# EAGLE design sensor (EAGLE 7.2.0)
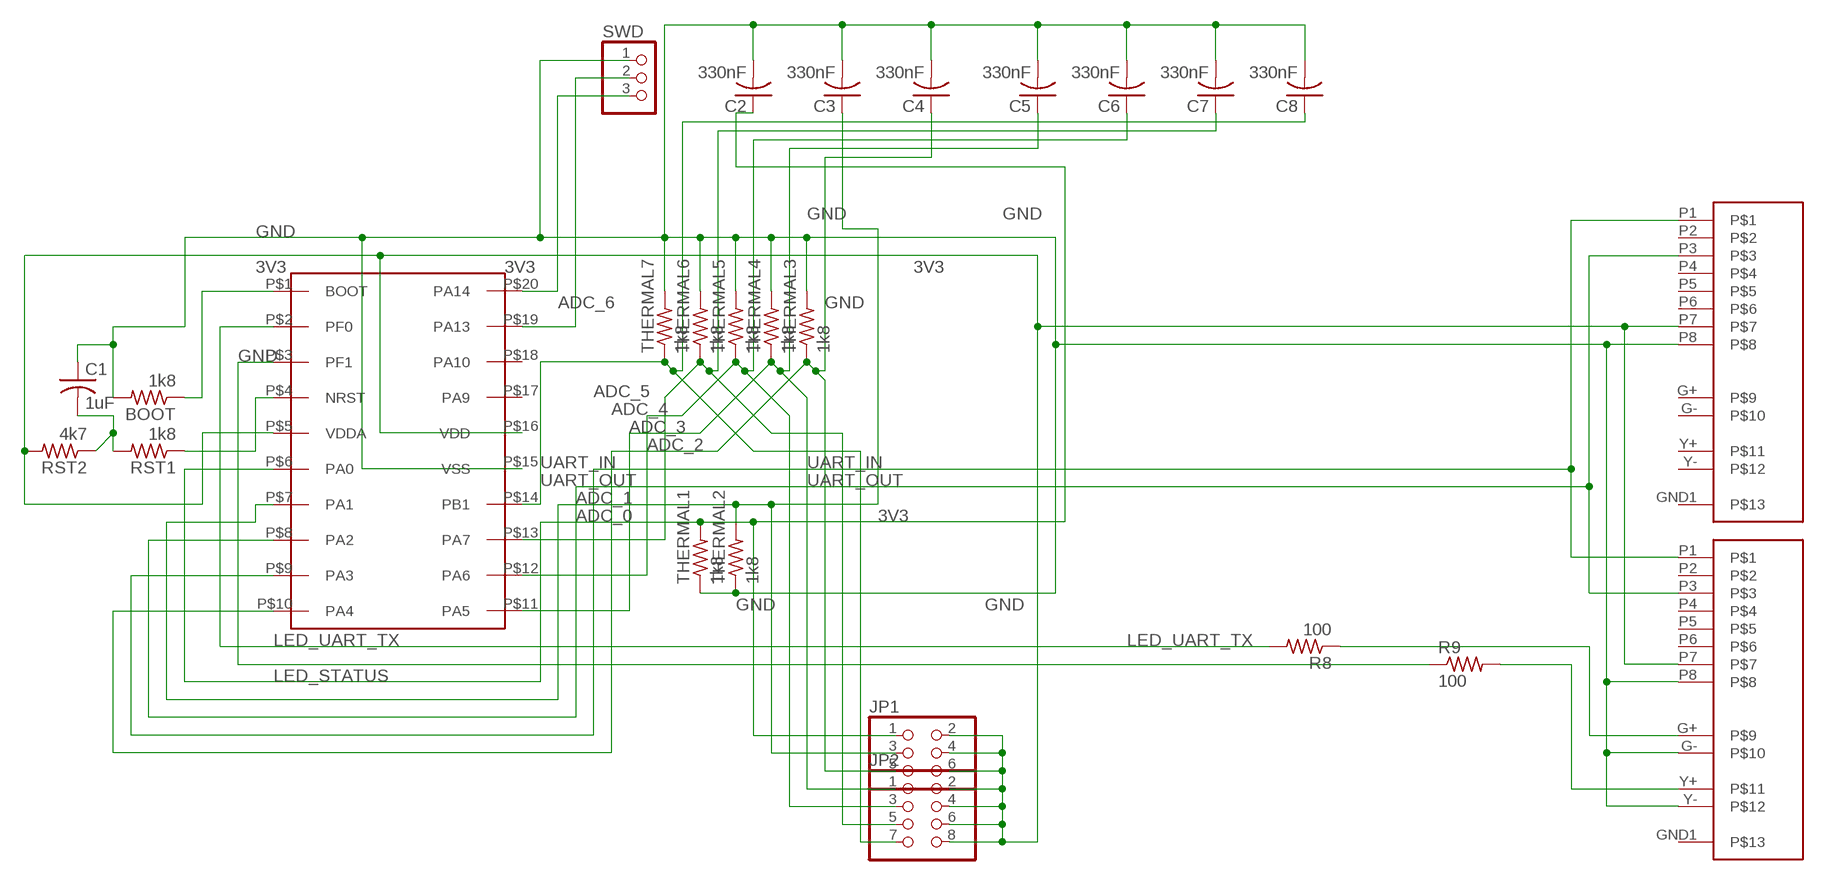
[diagram p0: schematic, sheet 1]

## Parts
BOOT  1k8  R-US_R1206  [R1206]
C1  1uF  C-USC0805  [C0805]
C2  330nF  C-USC0805  [C0805]
C3  330nF  C-USC0805  [C0805]
C4  330nF  C-USC0805  [C0805]
C5  330nF  C-USC0805  [C0805]
C6  330nF  C-USC0805  [C0805]
C7  330nF  C-USC0805  [C0805]
C8  330nF  C-USC0805  [C0805]
JP1  PINHD-2X3  [2X03]
JP2  PINHD-2X4  [2X04]
R8  100  R-US_R1206  [R1206]
R9  100  R-US_R1206  [R1206]
RST1  1k8  R-US_R1206  [R1206]
RST2  4k7  R-US_R1206  [R1206]
SWD  PINHD-1X3  [1X03]
THERMAL1  1k8  R-US_R1206  [R1206]
THERMAL2  1k8  R-US_R1206  [R1206]
THERMAL3  1k8  R-US_R1206  [R1206]
THERMAL4  1k8  R-US_R1206  [R1206]
THERMAL5  1k8  R-US_R1206  [R1206]
THERMAL6  1k8  R-US_R1206  [R1206]
THERMAL7  1k8  R-US_R1206  [R1206]
U$1  RJ-45_LEDS  [RJ-45_LEDS]
U$2  RJ-45_LEDS  [RJ-45_LEDS]
U$3  STM32F030  [TSSOP-TO-DIP20-600]

## Nets
3V3: JP1.2 JP1.4 JP1.6 JP2.2 JP2.4 JP2.6 JP2.8 RST2.2 U$1.P7 U$2.P7 U$3.P$5(VDDA) U$3.P$16(VDD)
ADC_0: C2.1 JP1.1 THERMAL1.2 U$3.P$6(PA0)
ADC_1: C3.1 JP1.3 THERMAL2.2 U$3.P$7(PA1)
ADC_2: C4.1 JP1.5 THERMAL3.1 U$3.P$10(PA4)
ADC_3: C5.1 JP2.1 THERMAL4.1 U$3.P$11(PA5)
ADC_4: C6.1 JP2.3 THERMAL5.1 U$3.P$12(PA6)
ADC_5: C7.1 JP2.5 THERMAL6.1 U$3.P$13(PA7)
ADC_6: C8.1 JP2.7 THERMAL7.1 U$3.P$14(PB1)
GND: BOOT.2 C1.1 C2.2 C3.2 C4.2 C5.2 C6.2 C7.2 C8.2 SWD.1 THERMAL1.1 THERMAL2.1 THERMAL3.2 THERMAL4.2 THERMAL5.2 THERMAL6.2 THERMAL7.2 U$1.P8 U$2.G- U$2.P8 U$2.Y- U$3.P$15(VSS)
LED_STATUS: R9.1 U$3.P$3(PF1)
LED_UART_TX: R8.2 U$3.P$2(PF0)
N$1: R8.1 U$2.G+
N$2: R9.2 U$2.Y+
N$3: BOOT.1 U$3.P$1(BOOT)
N$4: RST1.1 U$3.P$4(NRST)
N$5: C1.2 RST1.2 RST2.1
N$8: SWD.3 U$3.P$20(PA14)
N$9: SWD.2 U$3.P$19(PA13)
UART_IN: U$1.P1 U$2.P1 U$3.P$9(PA3)
UART_OUT: U$1.P3 U$2.P3 U$3.P$8(PA2)
Unconnected: U$1.P2 U$1.P4 U$1.P5 U$1.P6 U$2.P2 U$2.P4 U$2.P5 U$2.P6 U$3.P$17(PA9) U$3.P$18(PA10)

## Power pins joined to a net without a drawn wire
P$9: U$1.G+
P$10: U$1.G-
P$11: U$1.Y+
P$12: U$1.Y-
P$13: U$1.GND1 U$2.GND1

## Library data of the parts
BOOT R8 R9 RST1 RST2 THERMAL1-THERMAL7 = adafruit:R-US_: RESISTOR, American symbol
C1-C8 = adafruit:C-US: CAPACITOR, American symbol
JP1 = pinhead:PINHD-2X3: PIN HEADER
JP2 = pinhead:PINHD-2X4: PIN HEADER
SWD = adafruit:PINHD-1X3: PIN HEADER
U$1 U$2 = con-pc:RJ-45_LEDS: RJ-45 connector with 2 leds
U$3 = stm32:STM32F030

## Board
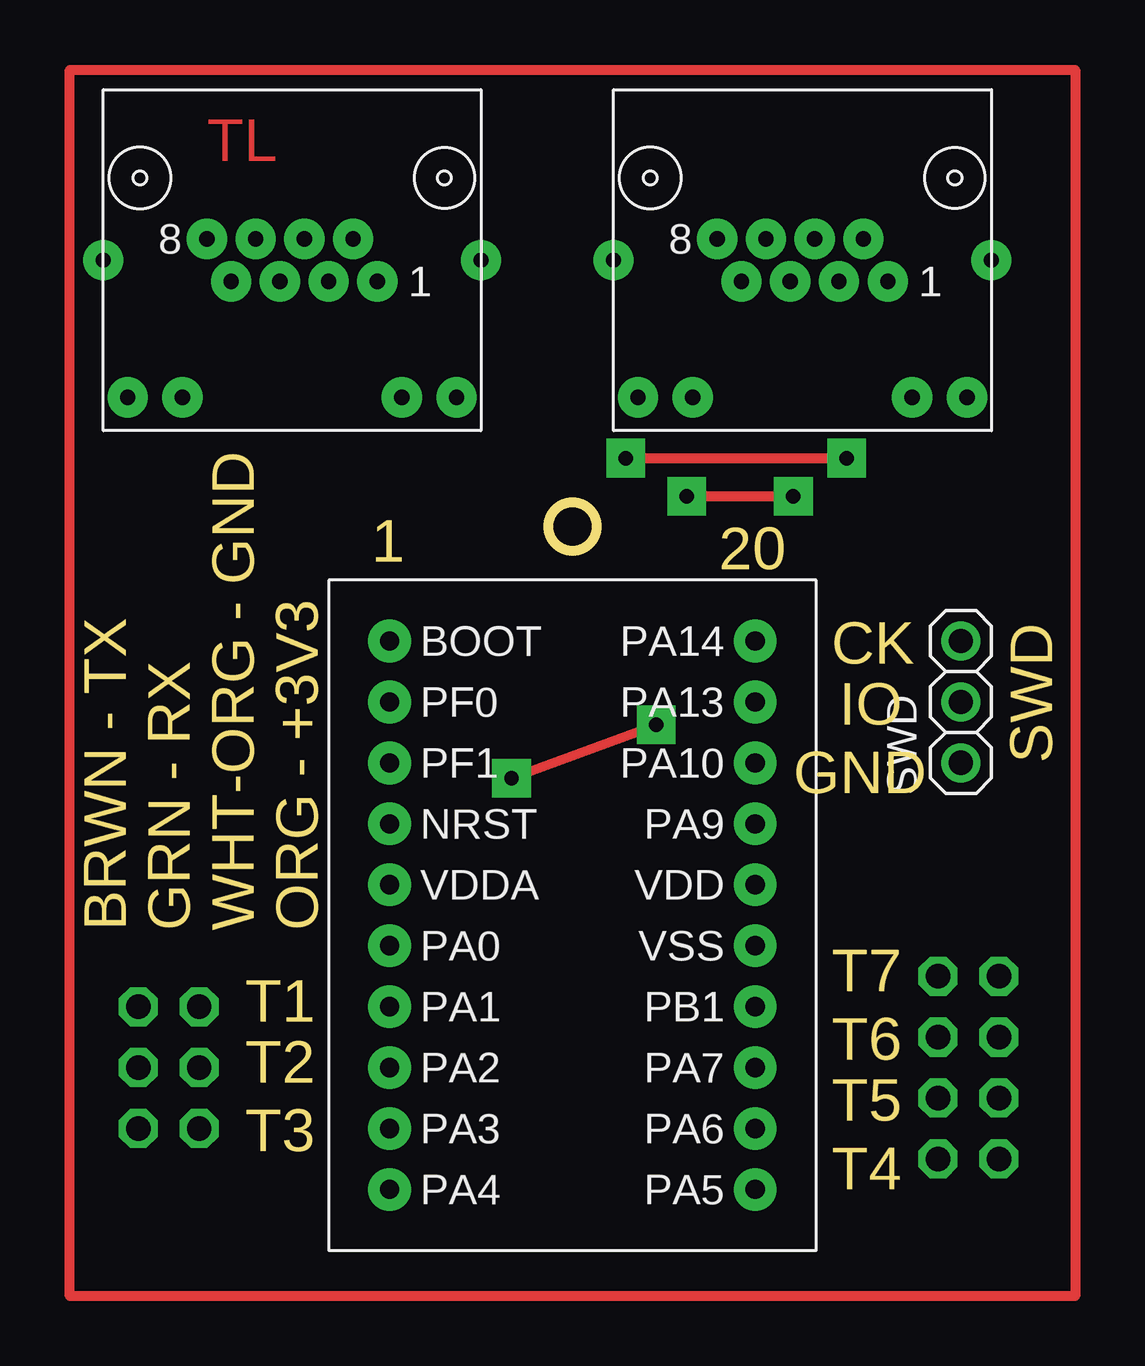
[diagram p1: board, top side]
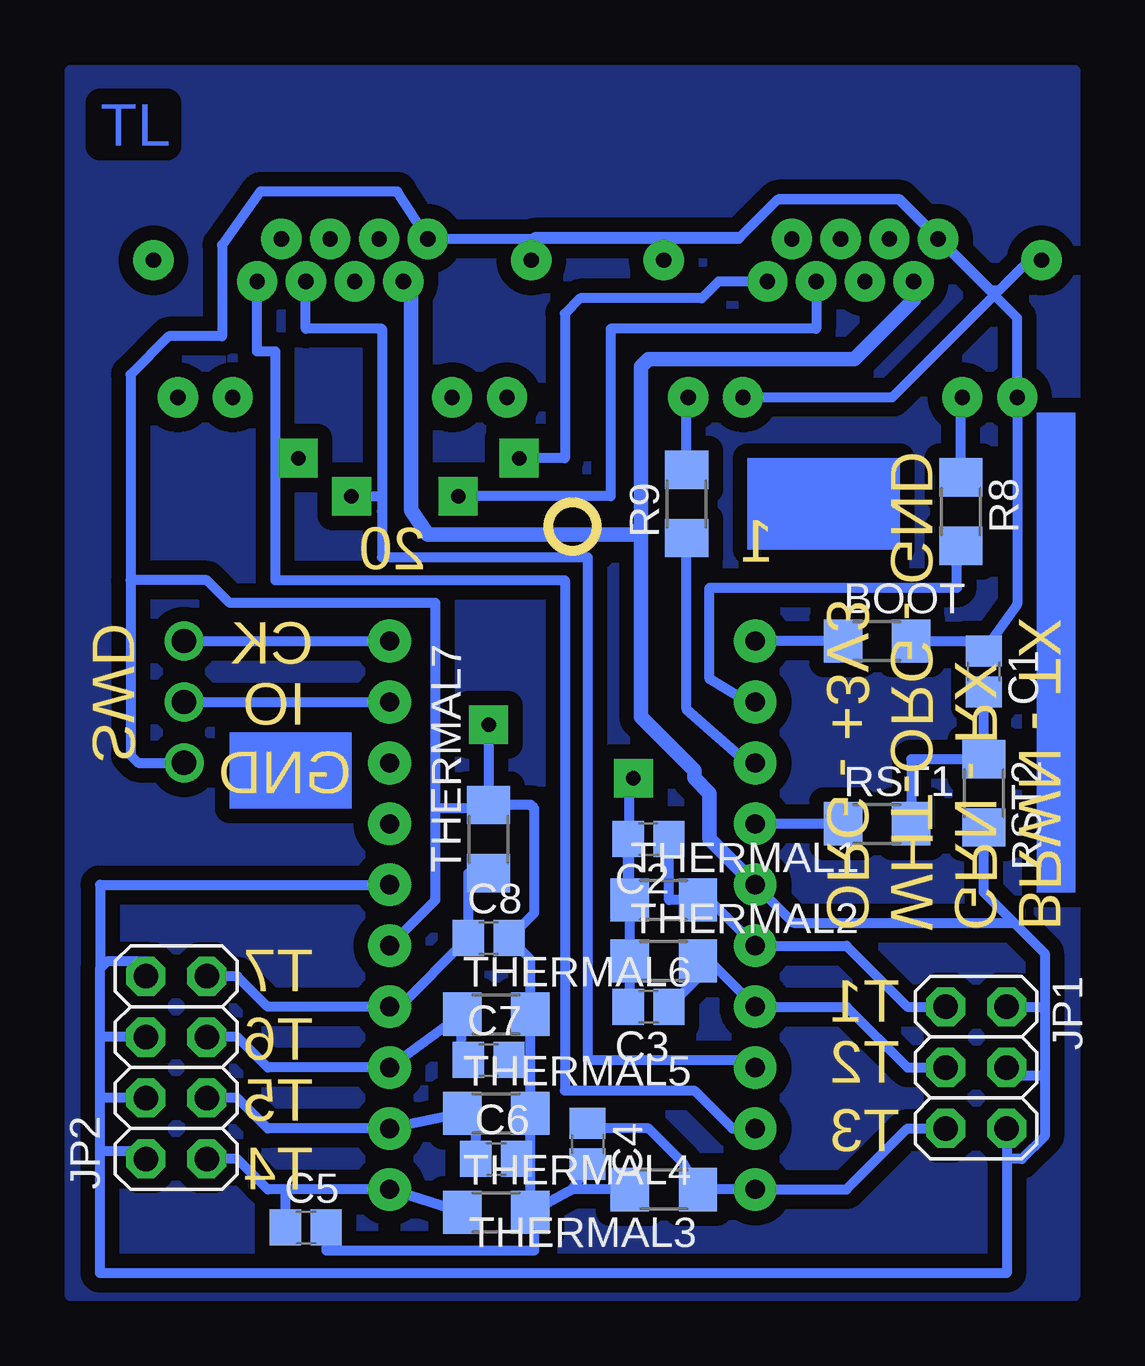
[diagram p2: board, bottom side, seen from below]

Size 2.01 x 2.01 mm. Coordinates in mm from the lower left corner, seen from the top.
Outline: circle at 1,1 radius 1
Copper layers (1*16): Top 0.035mm / dielectric 1.5mm / Bottom 0.035mm
Design rules "default *": minimum track width 10mil, minimum drill 24mil, track to track 8mil, track to pad 8mil, pad to pad 8mil, via to via 8mil, smd to smd 8mil, copper to edge 40mil, drill to drill 8mil, minimum pad ring 12mil, minimum via ring 20mil, stop-mask expansion 4mil, vias tented up to drill 0mil, thermal gap 10mil

### Footprints (pad centres in the part's own frame; a part is rotated, then mirrored left to right if it is on the bottom)
R1206 = smd 1.6 x 1.803: 1 -1.422,0; 2 1.422,0
C0805 = smd 1.3 x 1.5: 1 -0.85,0; 2 0.85,0
2X03 = drill 1.016 octagon: 1 -2.54,-1.27; 2 -2.54,1.27; 3 0,-1.27; 4 0,1.27; 5 2.54,-1.27; 6 2.54,1.27
2X04 = drill 1.016 octagon: 1 -3.81,-1.27; 2 -3.81,1.27; 3 -1.27,-1.27; 4 -1.27,1.27; 5 1.27,-1.27; 6 1.27,1.27; 7 3.81,-1.27; 8 3.81,1.27
1X03 = drill 1.016: 1 -2.54,0; 2 0,0; 3 2.54,0
RJ-45_LEDS = drill 0.635 pad 1.676: G+ -9.525,4.826; G- -9.525,7.112; GND -3.81,-7.62; GND1 -3.81,8.128; P1 -4.699,-3.302; P2 -2.921,-2.286; P3 -4.699,-1.27; P4 -2.921,-0.254; P5 -4.699,0.762; P6 -2.921,1.778; P7 -4.699,2.794; P8 -2.921,3.81; Y+ -9.525,-6.604; Y- -9.525,-4.318
TSSOP-TO-DIP20-600 = drill 0.8 pad 1.778: P$1 2.54,2.54; P$2 5.08,2.54; P$3 7.62,2.54; P$4 10.16,2.54; P$5 12.7,2.54; P$6 15.24,2.54; P$7 17.78,2.54; P$8 20.32,2.54; P$9 22.86,2.54; P$10 25.4,2.54; P$11 25.4,17.78; P$12 22.86,17.78; P$13 20.32,17.78; P$14 17.78,17.78; P$15 15.24,17.78; P$16 12.7,17.78; P$17 10.16,17.78; P$18 7.62,17.78; P$19 5.08,17.78; P$20 2.54,17.78

### Placement (x,y rotation side)
BOOT  -11.7,-3.76 0 bottom  (outside the outline)
C1  -16.14,-5.03 270 bottom  (outside the outline)
C2  -2.17,-12.01 180 bottom  (outside the outline)
C3  -2.17,-19 180 bottom  (outside the outline)
C4  0.37,-24.71 270 bottom  (outside the outline)
C5  12.12,-28.21 0 bottom  (outside the outline)
C6  4.18,-25.35 0 bottom  (outside the outline)
C7  4.5,-21.22 0 bottom  (outside the outline)
C8  4.5,-16.14 0 bottom  (outside the outline)
JP1  -15.82,-21.54 270 bottom  (outside the outline)
JP2  17.51,-21.54 90 bottom  (outside the outline)
R8  -15.19,1.64 270 bottom  (outside the outline)
R9  -3.76,1.96 90 bottom  (outside the outline)
RST1  -11.7,-11.38 0 bottom  (outside the outline)
RST2  -16.14,-10.11 270 bottom  (outside the outline)
SWD  17.2,-6.3 90 top  (outside the outline)
THERMAL1  -2.81,-14.55 0 bottom  (outside the outline)
THERMAL2  -2.81,-17.09 0 bottom  (outside the outline)
THERMAL3  -2.81,-26.62 180 bottom  (outside the outline)
THERMAL4  4.18,-27.57 0 bottom  (outside the outline)
THERMAL5  4.18,-23.44 0 bottom  (outside the outline)
THERMAL6  4.18,-19.32 0 bottom  (outside the outline)
THERMAL7  4.5,-12.01 90 bottom  (outside the outline)
U$1  10.85,15.93 90 top  (outside the outline)
U$2  -10.43,15.93 90 top  (outside the outline)
U$3  -9.16,-1.22 270 top  (outside the outline)

### Tracks (layer width: path | path; a pad name or v marks a point on that pad's centre or on a via)
3V3
  Bottom 0.406: JP2.8 18.78,-17.09 20.37,-17.09 20.69,-17.41 | U$3.P$16 20.69,-13.92 20.69,-17.41 | JP1.6 -17.09,-25.35 | -17.09,-25.35 -17.09,-30.11 20.69,-30.11 20.69,-25.03 | 20.69,-25.03 20.69,-22.81 | 20.69,-22.81 20.69,-20.27 | 20.69,-20.27 20.69,-17.41 | JP2.6 20.69,-20.27 | JP2.4 20.69,-22.81 | JP2.2 19.1,-25.03 20.69,-25.03 | U$3.P$5 -8.2,-15.51 -17.41,-15.51 | -17.41,-15.51 -18.68,-16.78 -18.68,-19 | -18.68,-19 -18.68,-21.86 | -18.68,-21.86 -18.68,-24.4 -17.73,-25.35 -17.09,-25.35 | JP1.4 -17.41,-21.86 -18.68,-21.86 | JP1.2 -18.68,-19 | -17.41,-15.51 -16.14,-14.24 RST2.2
  Bottom 0.61: U$2.P7 -13.22,10.47 -10.74,7.99 -2.17,7.99 -1.85,7.67 -1.85,1 | -1.85,1 -1.85,-6.93 -4.08,-9.16 -4.08,-9.47 -4.71,-10.11 -4.71,-12.01 U$3.P$5 | -1.85,1 -1.54,0.69 7.04,0.69 7.74,1.7 7.74,10.91 U$1.P7
ADC_0
  Bottom 0.406: JP1.1 -12.97,-19 -10.43,-16.46 U$3.P$6 -4.23,-14.07 THERMAL1.2 -3.02,-14.55 C2.1
ADC_1
  Bottom 0.406: JP1.3 -12.97,-21.54 -10.43,-19 U$3.P$7 -4.71,-17.09 THERMAL2.2 -4.23,-17.79 C3.1
ADC_2
  Bottom 0.406: JP1.5 -12.97,-24.08 -10.43,-26.62 U$3.P$10 THERMAL3.1 -3.59,-25.5 -2.17,-24.08 0.79,-24.08 C4.1
ADC_3
  Bottom 0.406: THERMAL4.1 U$3.P$11 12.75,-26.62 12.97,-26.62 | 12.97,-26.62 13.7,-26.62 14.97,-25.35 JP2.1 | C5.1 12.97,-26.62
ADC_4
  Bottom 0.406: JP2.3 14.97,-22.81 13.7,-24.08 U$3.P$12 THERMAL5.1 5.03,-24.02 C6.1
ADC_5
  Bottom 0.406: JP2.5 14.97,-20.27 13.7,-21.54 U$3.P$13 THERMAL6.1 5.66,-21.54 C7.1
ADC_6
  Bottom 0.406: JP2.7 14.97,-17.73 13.7,-19 U$3.P$14 8.2,-19 C8.1 5.35,-13.44 THERMAL7.1
GND  (via drill 0.6)
  Top 0.406: v-1.54,-9.47 v4.5,-7.25
  Bottom 0.406: THERMAL4.2 2.76,-25.35 | 2.76,-25.35 THERMAL5.2 2.76,-21.22 | 2.76,-21.22 THERMAL6.2 2.76,-17.03 C8.2 2.59,-15.09 2.59,-10.74 2.74,-10.59 THERMAL7.2 | -13.6,-3.76 BOOT.2 -16.01,-3.76 C1.1 -17.54,-2.23 U$2.G- -17.54,9.7 -16.58,10.66 | 1,-26.62 THERMAL3.2 -0.9,-26.62 | 1,-26.62 THERMAL4.2 | THERMAL1.1 -1.32,-13.92 C2.2 | C3.2 -1.38,-18.94 THERMAL2.1 THERMAL1.1 | C4.2 1,-26.62 | C7.2 2.76,-21.22 | C6.2 2.76,-25.35 | 19.42,-1.22 19.42,7.35 17.83,8.94 15.61,8.94 15.61,12.75 14.02,14.97 8.31,14.97 U$1.P8 -5.92,13.01 -7.57,14.66 -12.58,14.66 U$2.P8 -16.58,10.66 | 19.42,-1.22 19.42,-8.52 19.1,-8.84 SWD.1 | U$3.P$15 6.72,-14.55 6.72,-10.74 | 6.72,-10.74 6.72,-2.17 15.29,-2.17 16.24,-1.22 19.42,-1.22 | THERMAL7.2 4.65,-10.74 6.72,-10.74 | U$2.Y- -12.33,6.4 -16.58,10.66 | THERMAL1.1 -1.38,-9.96 v-1.54,-9.47 | v4.5,-7.25 THERMAL7.2 | C5.2 11.27,-29.16 2.59,-29.16 2.59,-27.57 THERMAL4.2
LED_STATUS
  Bottom 0.406: U$3.P$3 -6.3,-8.84 -3.76,-6.62 R9.1
LED_UART_TX
  Bottom 0.406: U$3.P$2 -6.3,-6.3 -4.71,-5.35 -4.71,-1.54 -15.02,-1.54 -15.02,0.05 R8.2
N$1
  Bottom 0.406: R8.1 -15.19,6.34 U$2.G+
N$2
  Bottom 0.406: R9.2 -3.76,6.34 U$2.Y+
N$3
  Bottom 0.406: BOOT.1 U$3.P$1
N$4
  Bottom 0.406: RST1.1 U$3.P$4
N$5
  Bottom 0.406: RST1.2 -13.12,-8.69 RST2.1 C1.2
N$6
  Top 0.406: -19.95,20.05 21.96,20.05 21.96,-31.06 -19.95,-31.06 -19.95,20.05
N$7
  pour Bottom (isolate 0.61): -19.95,-31.06 21.96,-31.06 21.96,20.05 -19.95,20.05
N$8
  Bottom 0.406: SWD.3 U$3.P$20
N$9
  Bottom 0.406: SWD.2 U$3.P$19
P$13
  Bottom 0.406: U$2.GND1 -18.05,12.12 -16.78,10.85 -16.46,10.85 -12.65,14.66 -7.57,14.66 -5.98,13.07 2.59,13.07 2.59,12.24 U$1.GND1
UART_IN  (via drill 0.6)
  Top 0.406: v3.23,3.86 v12.43,3.86
  Bottom 0.406: 13.39,3.86 13.39,8.31 14.15,8.31 U$1.P1 | 13.39,3.86 13.39,-1.22 1.32,-1.22 1.32,-22.49 -4.08,-22.49 -5.66,-24.08 U$3.P$9 | U$2.P1 -5.09,11.23 -4.39,10.53 0.69,10.53 1.32,9.89 1.32,3.86 v3.23,3.86 | v12.43,3.86 13.39,3.86
UART_OUT  (via drill 0.6)
  Top 0.406: v5.77,2.27 v10.21,2.27
  Bottom 0.406: 8.94,2.27 8.94,9.26 12.12,9.26 U$1.P3 | U$3.P$8 -6.62,-21.22 0.37,-21.22 0.37,-0.27 8.94,-0.27 8.94,1.64 8.94,2.27 | U$2.P3 -9.16,9.26 -0.58,9.26 -0.58,2.27 v5.77,2.27 | v10.21,2.27 8.94,2.27
(copper drawn outside any net)
  shapes: Bottom area x3

### Text on the board
Top: TL
Bottom: TL
Dimension: 1 | 20 | CK | IO | SWD | GND | BRWN - TX / GRN - RX / WHT-ORG - GND / ORG - +3V3 | T7 | T1 | T6 | T2 | T5 | T3 | T4